# EAGLE schematic ground_station_power_board (EAGLE 9.1.1)
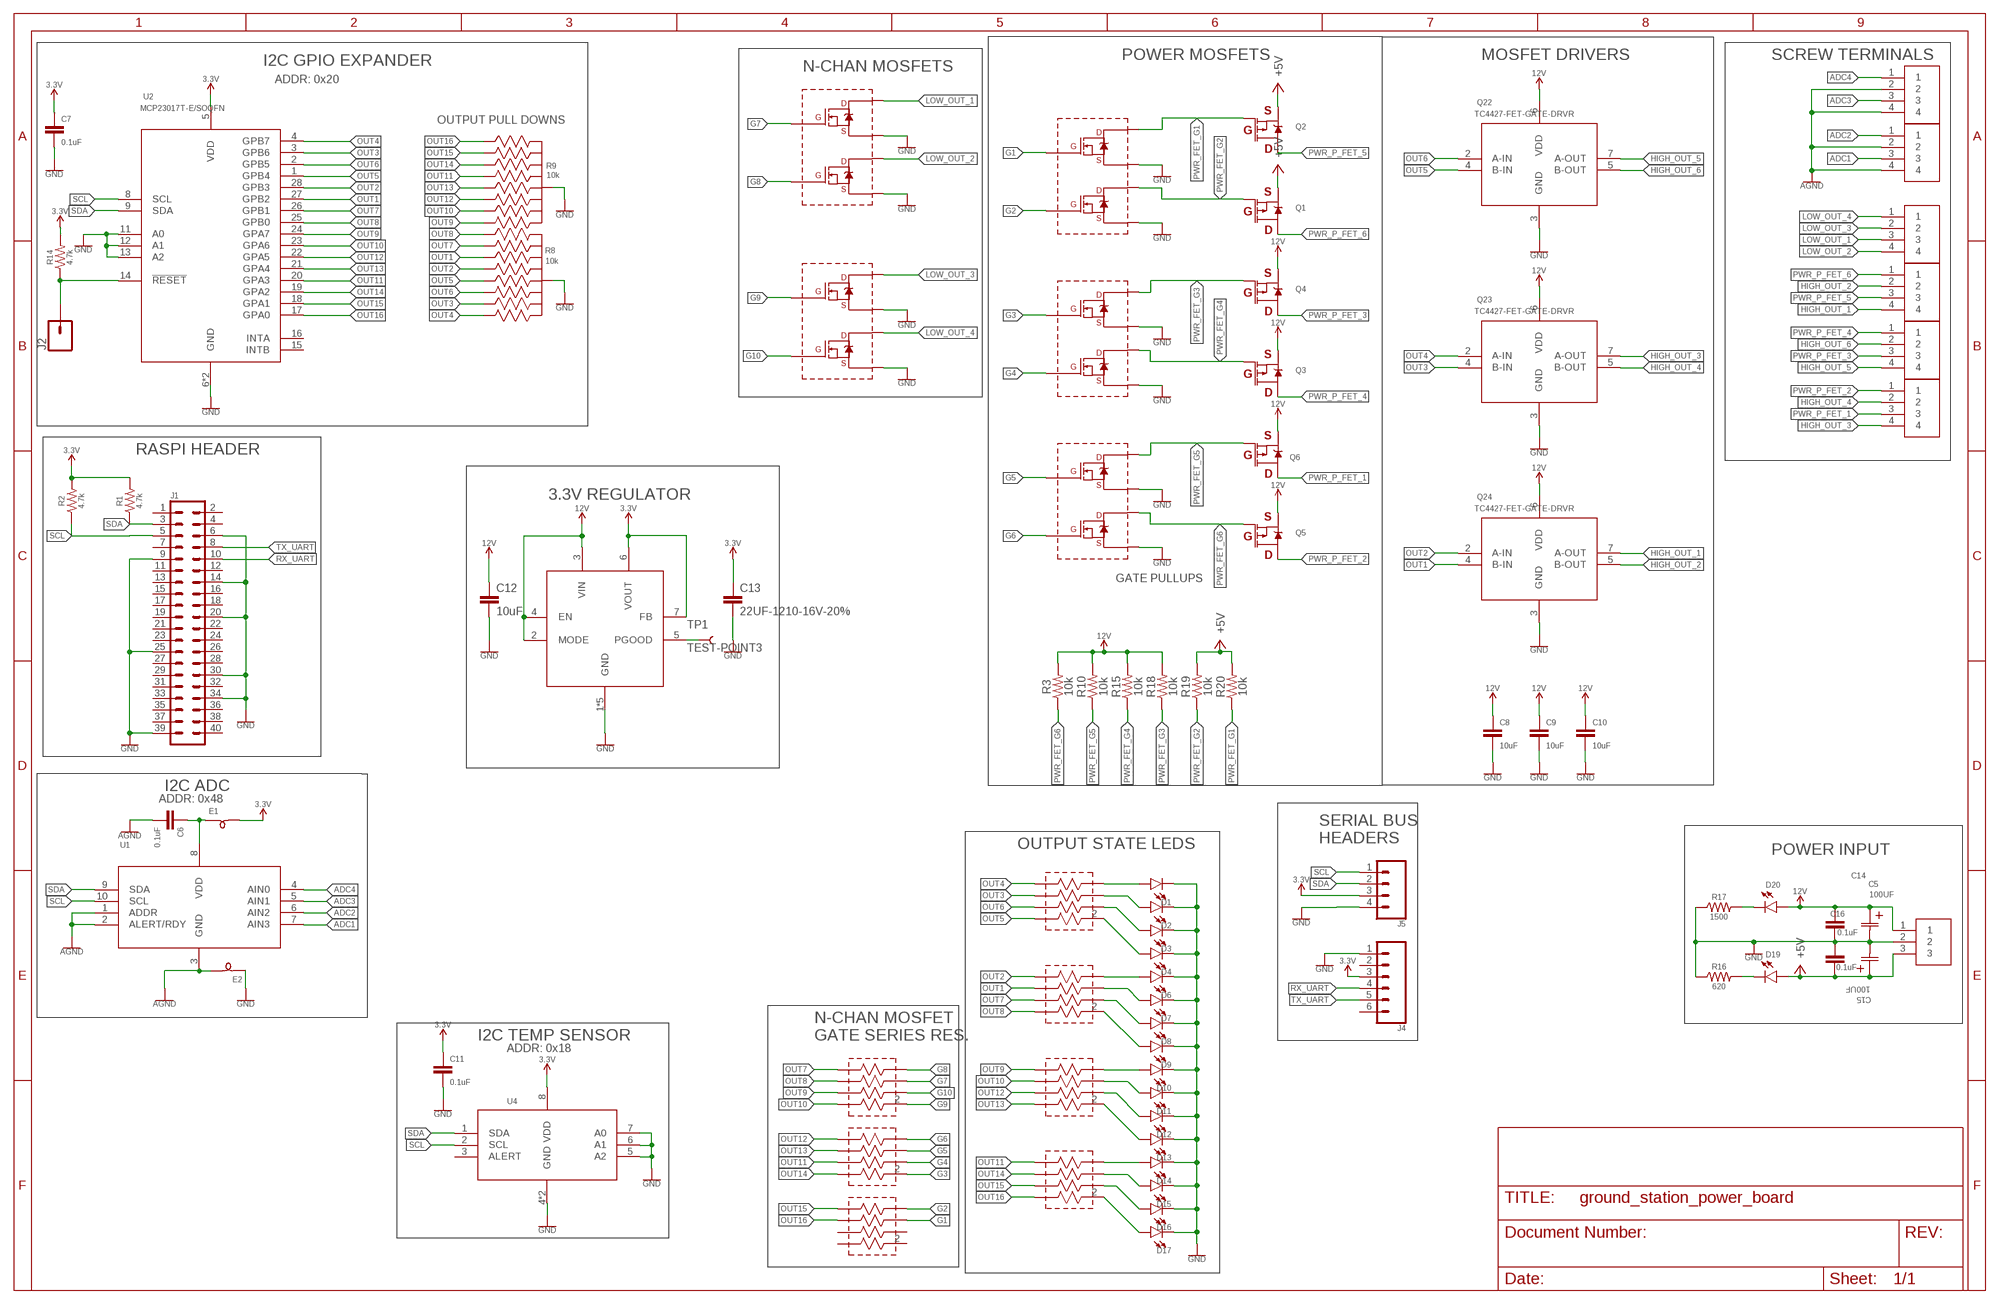
[diagram p0: schematic, sheet 1]

## Parts
C5  100UF  100UF-CAP-EMVH630ARA101MKE0SCHEMI-KE0-M  [CHEMI-KE0-M]
C6  0.1uF  0.1UF-0603-25V-5%  [0603]
C7  0.1uF  0.1UF-0603-25V-5%  [0603]
C8  10uF  10UF-0805-10V-10%  [0805]
C9  10uF  10UF-0805-10V-10%  [0805]
C10  10uF  10UF-0805-10V-10%  [0805]
C11  0.1uF  0.1UF-0603-25V-5%  [0603]
C12  10uF  10UF-1206-6.3V-20%  [1206]
C13  22UF-1210-16V-20%  [1210]
C14  0.1uF  0.1UF-0603-25V-5%  [0603]
C15  100UF  100UF-CAP-EMVH630ARA101MKE0SCHEMI-KE0-M  [CHEMI-KE0-M]
C16  0.1uF  0.1UF-0603-25V-5%  [0603]
D1  LED0603  [LED-0603]
D2  LED0603  [LED-0603]
D3  LED0603  [LED-0603]
D4  LED0603  [LED-0603]
D6  LED0603  [LED-0603]
D7  LED0603  [LED-0603]
D8  LED0603  [LED-0603]
D9  LED0603  [LED-0603]
D10  LED0603  [LED-0603]
D11  LED0603  [LED-0603]
D12  LED0603  [LED-0603]
D13  LED0603  [LED-0603]
D14  LED0603  [LED-0603]
D15  LED0603  [LED-0603]
D16  LED0603  [LED-0603]
D17  LED0603  [LED-0603]
D19  LED0603  [LED-0603]
D20  LED0603  [LED-0603]
E1  L-BEAD-0805-B  [.0805-B]
E2  L-BEAD-0805-B  [.0805-B]
J1  CONN_20X2SHROUDED  [2X20_SHROUDED]
J2  CONN_01PTH_NO_SILK_KIT  [1X01NS_KIT]
J4  CONN_06LONGPADS  [1X06_LONGPADS]
J5  CONN_04LONGPADS  [1X04_LONGPADS]
Q1  SQJ459EP_MOSFET_P_CHAN  [POWERPAK_S0-8L]
Q2  SQJ459EP_MOSFET_P_CHAN  [POWERPAK_S0-8L]
Q3  SQJ459EP_MOSFET_P_CHAN  [POWERPAK_S0-8L]
Q4  SQJ459EP_MOSFET_P_CHAN  [POWERPAK_S0-8L]
Q5  SQJ459EP_MOSFET_P_CHAN  [POWERPAK_S0-8L]
Q6  SQJ459EP_MOSFET_P_CHAN  [POWERPAK_S0-8L]
Q8  DMN61D8LVT-DUAL-N-CHANNEL-MOSFET  [TSOT26]
Q9  DMN61D8LVT-DUAL-N-CHANNEL-MOSFET  [TSOT26]
Q15  DMN61D8LVT-DUAL-N-CHANNEL-MOSFET  [TSOT26]
Q17  DMN61D8LVT-DUAL-N-CHANNEL-MOSFET  [TSOT26]
Q18  DMN61D8LVT-DUAL-N-CHANNEL-MOSFET  [TSOT26]
Q22  TC4427-FET-GATE-DRVR  [TSSOP-8]
Q23  TC4427-FET-GATE-DRVR  [TSSOP-8]
Q24  TC4427-FET-GATE-DRVR  [TSSOP-8]
R1  4.7k  4.7KOHM-0603-1/10W-1%  [0603]
R2  4.7k  4.7KOHM-0603-1/10W-1%  [0603]
R3  10k  10KOHM-0603-1/10W-1%  [0603]
R4  680  RES-ARRAY-742C083  [RES-ARRAY-742C083]
R5  680  RES-ARRAY-742C083  [RES-ARRAY-742C083]
R6  680  RES-ARRAY-742C083  [RES-ARRAY-742C083]
R7  680  RES-ARRAY-742C083  [RES-ARRAY-742C083]
R8  10k  EXB-A10P391JC_ARRAY_EXBA-M  [C_ARRAY_EXBA-M]
R9  10k  EXB-A10P391JC_ARRAY_EXBA-M  [C_ARRAY_EXBA-M]
R10  10k  10KOHM-0603-1/10W-1%  [0603]
R11  220  RES-ARRAY-742C083  [RES-ARRAY-742C083]
R12  220  RES-ARRAY-742C083  [RES-ARRAY-742C083]
R13  220  RES-ARRAY-742C083  [RES-ARRAY-742C083]
R14  4.7k  4.7KOHM-0603-1/10W-1%  [0603]
R15  10k  10KOHM-0603-1/10W-1%  [0603]
R16  620  4.7KOHM-0603-1/10W-1%  [0603]
R17  1500  4.7KOHM-0603-1/10W-1%  [0603]
R18  10k  10KOHM-0603-1/10W-1%  [0603]
R19  10k  10KOHM-0603-1/10W-1%  [0603]
R20  10k  10KOHM-0603-1/10W-1%  [0603]
TP1  TEST-POINT3  [PAD.03X.03]
U1  ADS1115IDGSTDGS10-M  [DGS10-M]
U2  MCP23017T-E/SOQFN  [QFN28_6X6MC-M]
U4  MCP9808T-E/MCDFN8_2X3MC-M  [DFN8_2X3MC-M]
U$1  1719031-PHONEIX-CONTACT-DBL-TERMINAL-BLOCK  [1719031-PHONEIX-CONTACT-DBL-TERMINAL-BLOCK]
U$2  1719031-PHONEIX-CONTACT-DBL-TERMINAL-BLOCK  [1719031-PHONEIX-CONTACT-DBL-TERMINAL-BLOCK]
U$3  1719031-PHONEIX-CONTACT-DBL-TERMINAL-BLOCK  [1719031-PHONEIX-CONTACT-DBL-TERMINAL-BLOCK]
U$4  1719031-PHONEIX-CONTACT-DBL-TERMINAL-BLOCK  [1719031-PHONEIX-CONTACT-DBL-TERMINAL-BLOCK]
U$5  1719031-PHONEIX-CONTACT-DBL-TERMINAL-BLOCK  [1719031-PHONEIX-CONTACT-DBL-TERMINAL-BLOCK]
U$6  1719031-PHONEIX-CONTACT-DBL-TERMINAL-BLOCK  [1719031-PHONEIX-CONTACT-DBL-TERMINAL-BLOCK]
U$9  LMZM23601V3SILT  [MICRO-SIP]
U$11  1714968-PHONEIX-CONTACT-TERMINAL-BLOCK  [1714968-PHONEIX-CONTACT-3-TERMINAL-BLOCK]

## Nets
3.3V: C7.1 C11.1 C13.1 E1.2 J4.3 J5.3 R1.2 R2.2 R14.2 U2.5(VDD) U4.8(VDD) U$9.6(VOUT) U$9.7(FB)
12V: C5.1 C8.1 C9.1 C10.1 C12.1 C14.1 D20.A Q3.S1(S) Q3.S2(S) Q3.S3(S) Q4.S1(S) Q4.S2(S) Q4.S3(S) Q5.S1(S) Q5.S2(S) Q5.S3(S) Q6.S1(S) Q6.S2(S) Q6.S3(S) Q22.6(VDD) Q23.6(VDD) Q24.6(VDD) R3.2 R10.2 R15.2 R18.2 U$9.2(MODE) U$9.3(VIN) U$9.4(EN) U$11.1
+5V: C15.1 C16.2 D19.A Q1.S1(S) Q1.S2(S) Q1.S3(S) Q2.S1(S) Q2.S2(S) Q2.S3(S) R19.2 R20.2 U$11.3
ADC1: U1.7(AIN3) U$5.3
ADC2: U1.6(AIN2) U$5.1
ADC3: U1.5(AIN1) U$6.3
ADC4: U1.4(AIN0) U$6.1
AGND: C6.2 E2.2 U1.1(ADDR) U1.2(ALERT/RDY) U1.3(GND) U$5.2 U$5.4 U$6.2 U$6.4
G1: Q8.5(G2) R11.6(!1OE6)
G2: Q8.2(G1) R11.8(!1OE8)
G3: Q9.5(G2) R12.2(!1OE2)
G4: Q9.2(G1) R12.4(!1OE4)
G5: Q15.5(G2) R12.6(!1OE6)
G6: Q15.2(G1) R12.8(!1OE8)
G7: Q18.5(G2) R13.6(!1OE6)
G8: Q18.2(G1) R13.8(!1OE8)
G9: Q17.5(G2) R13.2(!1OE2)
G10: Q17.2(G1) R13.4(!1OE4)
GND: C5.2 C7.2 C8.2 C9.2 C10.2 C11.2 C12.2 C13.2 C14.2 C15.2 C16.1 D1.C D2.C D3.C D4.C D6.C D7.C D8.C D9.C D10.C D11.C D12.C D13.C D14.C D15.C D16.C D17.C E2.1 J1.6 J1.9 J1.14 J1.20 J1.25 J1.30 J1.34 J1.39 J4.1 J5.4 Q8.1(S1) Q8.4(S2) Q9.1(S1) Q9.4(S2) Q15.1(S1) Q15.4(S2) Q17.1(S1) Q17.4(S2) Q18.1(S1) Q18.4(S2) Q22.3(GND) Q23.3(GND) Q24.3(GND) R8.5 R8.10 R9.5 R9.10 R16.1 R17.1 U2.6(GND) U2.11(A0) U2.12(A1) U2.13(A2) U2.29(GND) U4.4(GND) U4.5(A2) U4.6(A1) U4.7(A0) U4.9(GND) U$9.1(GND) U$9.TP(GND) U$9.V1(GND) U$9.V2(GND) U$9.V3(GND) U$11.2
HIGH_OUT_1: Q24.7(A-OUT) U$3.4
HIGH_OUT_2: Q24.5(B-OUT) U$3.2
HIGH_OUT_3: Q23.7(A-OUT) U$1.4
HIGH_OUT_4: Q23.5(B-OUT) U$1.2
HIGH_OUT_5: Q22.7(A-OUT) U$2.4
HIGH_OUT_6: Q22.5(B-OUT) U$2.2
LOW_OUT_1: Q18.3(D2) U$4.3
LOW_OUT_2: Q18.6(D1) U$4.4
LOW_OUT_3: Q17.3(D2) U$4.2
LOW_OUT_4: Q17.6(D1) U$4.1
N$1: D1.A R4.8(!1OE8)
N$2: D2.A R4.6(!1OE6)
N$3: D3.A R4.4(!1OE4)
N$4: D4.A R4.2(!1OE2)
N$5: C6.1 E1.1 U1.8(VDD)
N$6: J2.1 R14.1 U2.14(!RESET)
N$7: TP1.P$1 U$9.5(PGOOD)
N$12: D19.C R16.2
N$14: D6.A R5.8(!1OE8)
N$15: D7.A R5.6(!1OE6)
N$16: D8.A R5.4(!1OE4)
N$17: D9.A R5.2(!1OE2)
N$18: D20.C R17.2
N$26: D10.A R6.8(!1OE8)
N$27: D11.A R6.6(!1OE6)
N$28: D12.A R6.4(!1OE4)
N$29: D13.A R6.2(!1OE2)
N$38: D14.A R7.8(!1OE8)
N$39: D15.A R7.6(!1OE6)
N$40: D16.A R7.4(!1OE4)
N$41: D17.A R7.2(!1OE2)
OUT1: Q24.4(B-IN) R5.5(!1OE5) R8.2 U2.27(GPB2)
OUT2: Q24.2(A-IN) R5.7(!1OE7) R8.8 U2.28(GPB3)
OUT3: Q23.4(B-IN) R4.5(!1OE5) R8.4 U2.3(GPB6)
OUT4: Q23.2(A-IN) R4.7(!1OE7) R8.6 U2.4(GPB7)
OUT5: Q22.4(B-IN) R4.1(!1OE1) R8.3 U2.1(GPB4)
OUT6: Q22.2(A-IN) R4.3(!1OE3) R8.7 U2.2(GPB5)
OUT7: R5.3(!1OE3) R8.9 R13.7(!1OE7) U2.26(GPB1)
OUT8: R5.1(!1OE1) R8.1 R13.5(!1OE5) U2.25(GPB0)
OUT9: R6.7(!1OE7) R9.6 R13.3(!1OE3) U2.24(GPA7)
OUT10: R6.5(!1OE5) R9.4 R13.1(!1OE1) U2.23(GPA6)
OUT11: R7.7(!1OE7) R9.8 R12.3(!1OE3) U2.20(GPA3)
OUT12: R6.3(!1OE3) R9.7 R12.7(!1OE7) U2.22(GPA5)
OUT13: R6.1(!1OE1) R9.3 R12.5(!1OE5) U2.21(GPA4)
OUT14: R7.5(!1OE5) R9.2 R12.1(!1OE1) U2.19(GPA2)
OUT15: R7.3(!1OE3) R9.9 R11.7(!1OE7) U2.18(GPA1)
OUT16: R7.1(!1OE1) R9.1 R11.5(!1OE5) U2.17(GPA0)
PWR_FET_G1: Q2.G Q8.3(D2) R20.1
PWR_FET_G2: Q1.G Q8.6(D1) R19.1
PWR_FET_G3: Q4.G Q9.3(D2) R18.1
PWR_FET_G4: Q3.G Q9.6(D1) R15.1
PWR_FET_G5: Q6.G Q15.3(D2) R10.1
PWR_FET_G6: Q5.G Q15.6(D1) R3.1
PWR_P_FET_1: Q6.D1(D) U$1.3
PWR_P_FET_2: Q5.D1(D) U$1.1
PWR_P_FET_3: Q4.D1(D) U$2.3
PWR_P_FET_4: Q3.D1(D) U$2.1
PWR_P_FET_5: Q2.D1(D) U$3.3
PWR_P_FET_6: Q1.D1(D) U$3.1
RX_UART: J1.10 J4.4
SCL: J1.5 J5.1 R2.1 U1.10(SCL) U2.8(SCL) U4.2(SCL)
SDA: J1.3 J5.2 R1.1 U1.9(SDA) U2.9(SDA) U4.1(SDA)
TX_UART: J1.8 J4.5
Unconnected: J1.1 J1.2 J1.4 J1.7 J1.11 J1.12 J1.13 J1.15 J1.16 J1.17 J1.18 J1.19 J1.21 J1.22 J1.23 J1.24 J1.26 J1.27 J1.28 J1.29 J1.31 J1.32 J1.33 J1.35 J1.36 J1.37 J1.38 J1.40 J4.2 J4.6 R11.1(!1OE1) R11.2(!1OE2) R11.3(!1OE3) R11.4(!1OE4) U2.15(INTB) U2.16(INTA) U4.3(ALERT)

## Notes on the sheet
- POWER MOSFETS | MOSFET DRIVERS | SCREW TERMINALS
- I2C GPIO EXPANDER
- N-CHAN MOSFETS
- ADDR: 0x20
- OUTPUT PULL DOWNS
- RASPI HEADER
- 3.3V REGULATOR
- GATE PULLUPS
- I2C ADC
- ADDR: 0x48
- SERIAL BUS
  HEADERS
- OUTPUT STATE LEDS
- POWER INPUT
- I2C TEMP SENSOR
- N-CHAN MOSFET
  GATE SERIES RES.
- ADDR: 0x18

## Library data of the parts
C5 C15 = GROUND-STATION-POWER-BOARD:100UF-CAP-EMVH630ARA101MKE0S; MANUFACTURER_PART_NUMBER: EMVH630ARA101MKE0S; VENDOR: Nippon ChemiCon
C6 C7 C11 C14 C16 = SparkFun-Capacitors:0.1UF: 0.1µF ceramic capacitors A capacitor is a passive two-terminal electrical component used to store electrical energy temporarily in an electric field.; PROD_ID: CAP-08604
C8-C10 = SparkFun-Capacitors:10UF: 10.0µF ceramic capacitors A capacitor is a passive two-terminal electrical component used to store electrical energy temporarily in an electric field.; PROD_ID: CAP-11330
C12 = SparkFun-Capacitors:10UF: 10.0µF ceramic capacitors A capacitor is a passive two-terminal electrical component used to store electrical energy temporarily in an electric field.; PROD_ID: CAP-10057
C13 = SparkFun-Capacitors:22UF: 22µF ceramic capacitors A capacitor is a passive two-terminal electrical component used to store electrical energy temporarily in an electric field.
D1-D4 D6-D17 D19 D20 = SparkFun-LED:LED: LED (Generic) Standard schematic elements and footprints for 5mm, 3mm, 1206, and 0603 sized LEDs. Generic LEDs with no color specified.
E1 E2 = oresat-rcl:L-BEAD-*: Bead or Chip inductor ("ferrite bead") for EMI suppression
J1 = SparkFun-Connectors:CONN_20X2: Multi connection point. Often used as Generic Header-pin footprint for 0.1 inch spaced/style header connections On any of the 0.1 inch spaced packages, you can populate with these: Break Away Headers - Straight <https://www.sparkfun.com/products/116> (PRT-00116) Break Away Male Headers - Right Angle <https://www.sparkfun.com/products/553> (PRT-00553) Female Headers <https://www.sparkfun.com/products/115> (PRT-00115) Break Away Headers - Machine Pin <https://www.sparkfun.com/products/117> (PRT-00117) Break Away Female Headers - Swiss Machine Pin <https://www.sparkfun.com/products/743> (PRT-00743); PROD_ID: CONN-12263; SF_ID: CONN-12263
J2 = SparkFun-Connectors:CONN_01: Single connection point. Often used as Generic Header-pin footprint for 0.1 inch spaced/style header connections On any of the 0.1 inch spaced packages, you can populate with these: Break Away Headers - Straight <https://www.sparkfun.com/products/116> (PRT-00116) Break Away Male Headers - Right Angle <https://www.sparkfun.com/products/553> (PRT-00553) Female Headers <https://www.sparkfun.com/products/115> (PRT-00115) Break Away Headers - Machine Pin <https://www.sparkfun.com/products/117> (PRT-00117) Break Away Female Headers - Swiss Machine Pin <https://www.sparkfun.com/products/743> (PRT-00743) This device is also useful as a general connection point to wire up your design to another part of your project. Our various solder wires solder well into these plated through hole pads. Hook-Up Wire - Assortment (Stranded, 22 AWG) <https://www.sparkfun.com/products/11375> (PRT-11375) Hook-Up Wire - Assortment (Solid Core, 22 AWG) <https://www.sparkfun.com/products/11367> (PRT-11367) View the entire wire category on our website here <https://www.sparkfun.com/categories/141> Special notes: SMTSO-256-ET is a "flush mount" nut for a 4-40 screw. We mostly use this on specialty testbeds; it is a nice way to connect hardware to your PCB at an adjustable hieght. Also note, the SNAP packages are for using a snappable style connector. We sell a baggie of snaps and they are also used on two LilyPad designs: Snap Assortment - 30 pack (male and female) <https://www.sparkfun.com/products/11347> (DEV-11347) LilyPad Arduino SimpleSnap <https://www.sparkfun.com/products/10941> (DEV-10941) LilyPad SimpleSnap Protoboard <https://www.sparkfun.com/products/10940> (DEV-10940)
J4 = SparkFun-Connectors:CONN_06: Multi connection point. Often used as Generic Header-pin footprint for 0.1 inch spaced/style header connections On any of the 0.1 inch spaced packages, you can populate with these: Break Away Headers - Straight <https://www.sparkfun.com/products/116> (PRT-00116) Break Away Male Headers - Right Angle <https://www.sparkfun.com/products/553> (PRT-00553) Female Headers <https://www.sparkfun.com/products/115> (PRT-00115) Break Away Headers - Machine Pin <https://www.sparkfun.com/products/117> (PRT-00117) Break Away Female Headers - Swiss Machine Pin <https://www.sparkfun.com/products/743> (PRT-00743) Arduino Stackable Header - 6 Pin <https://www.sparkfun.com/products/9280> (PRT-09280) For SCREWTERMINALS and SPRING TERMINALS visit here: Screw Terimnals on SparkFun.com <https://www.sparkfun.com/search/results?term=Screw+Terminals> (5mm/3.5mm/2.54mm spacing) This device is also useful as a general connection point to wire up your design to another part of your project. Our various solder wires solder well into these plated through hole pads. Hook-Up Wire - Assortment (Stranded, 22 AWG) <https://www.sparkfun.com/products/11375> (PRT-11375) Hook-Up Wire - Assortment (Solid Core, 22 AWG) <https://www.sparkfun.com/products/11367> (PRT-11367) View the entire wire category on our website here <https://www.sparkfun.com/categories/141>
J5 = SparkFun-Connectors:CONN_04: Multi connection point. Often used as Generic Header-pin footprint for 0.1 inch spaced/style header connections On any of the 0.1 inch spaced packages, you can populate with these: Break Away Headers - Straight <https://www.sparkfun.com/products/116> (PRT-00116) Break Away Male Headers - Right Angle <https://www.sparkfun.com/products/553> (PRT-00553) Female Headers <https://www.sparkfun.com/products/115> (PRT-00115) Break Away Headers - Machine Pin <https://www.sparkfun.com/products/117> (PRT-00117) Break Away Female Headers - Swiss Machine Pin <https://www.sparkfun.com/products/743> (PRT-00743) For SCREWTERMINALS and SPRING TERMINALS visit here: Screw Terimnals on SparkFun.com <https://www.sparkfun.com/search/results?term=Screw+Terminals> (5mm/3.5mm/2.54mm spacing) This device is also useful as a general connection point to wire up your design to another part of your project. Our various solder wires solder well into these plated through hole pads. Hook-Up Wire - Assortment (Stranded, 22 AWG) <https://www.sparkfun.com/products/11375> (PRT-11375) Hook-Up Wire - Assortment (Solid Core, 22 AWG) <https://www.sparkfun.com/products/11367> (PRT-11367) View the entire wire category on our website here <https://www.sparkfun.com/categories/141> Special notes: Molex polarized connector foot print use with SKU : PRT-08231 with associated crimp pins and housings. 1MM SMD Version SKU: PRT-10208; PROD_ID: CONN-09696
Q1-Q6 = GROUND-STATION-POWER-BOARD:SQJ459EP_MOSFET_P_CHAN
Q8 Q9 Q15 Q17 Q18 = GROUND-STATION-POWER-BOARD:DMN61D8LVT-DUAL-N-CHANNEL-MOSFET
Q22-Q24 = GROUND-STATION-POWER-BOARD:TC4427-FET-GATE-DRVR
R1 R2 R14 = SparkFun-Resistors:4.7KOHM: 4.7kΩ resistor A resistor is a passive two-terminal electrical component that implements electrical resistance as a circuit element. Resistors act to reduce current flow, and, at the same time, act to lower voltage levels within circuits. - Wikipedia; PROD_ID: RES-07857
R3 R10 R15 R18-R20 = SparkFun-Resistors:10KOHM: 10kΩ resistor A resistor is a passive two-terminal electrical component that implements electrical resistance as a circuit element. Resistors act to reduce current flow, and, at the same time, act to lower voltage levels within circuits. - Wikipedia; PROD_ID: RES-00824
R4-R7 R11-R13 = GROUND-STATION-POWER-BOARD:RES-ARRAY-742C083
R8 R9 = temp-lib:EXB-A10P391J; MANUFACTURER_PART_NUMBER: EXBA10P391J; VENDOR: Panasonic
R16 R17 = SparkFun-Resistors:4.7KOHM: 4.7kΩ resistor A resistor is a passive two-terminal electrical component that implements electrical resistance as a circuit element. Resistors act to reduce current flow, and, at the same time, act to lower voltage levels within circuits. - Wikipedia; PROD_ID: RES-07857; VALUE: 4.7k
TP1 = SparkFun-Connectors:TEST-POINT: SparkFun Test Points Bare copper test points for troubleshooting or In-Circuit-Testing. These are used by our Production team for verifying production board runs using pogo-pins on test beds. SparkFun Products: SparkFun LSM9DS1 Breakout <https://www.sparkfun.com/products/13284> SparkFun PSOC <https://www.sparkfun.com/products/13714> SparkFun Load Cell Amplifier <https://www.sparkfun.com/products/13879>
U1 = GROUND-STATION-POWER-BOARD:ADS1115IDGST; MANUFACTURER_PART_NUMBER: ADS1115IDGST; VENDOR: Texas Instruments
U2 = GROUND-STATION-POWER-BOARD:MCP23017T-E/SO
U4 = GROUND-STATION-POWER-BOARD:MCP9808T-E/MC; MANUFACTURER_PART_NUMBER: MCP9808TEMC; VENDOR: Microchip
U$1-U$6 = GROUND-STATION-POWER-BOARD:1719031-PHONEIX-CONTACT-DBL-TERMINAL-BLOCK
U$9 = GROUND-STATION-POWER-BOARD:LMZM23601V3SILT
U$11 = GROUND-STATION-POWER-BOARD:1714968-PHONEIX-CONTACT-TERMINAL-BLOCK